# EAGLE design LasaurDriverBoard2 (EAGLE 6.4)
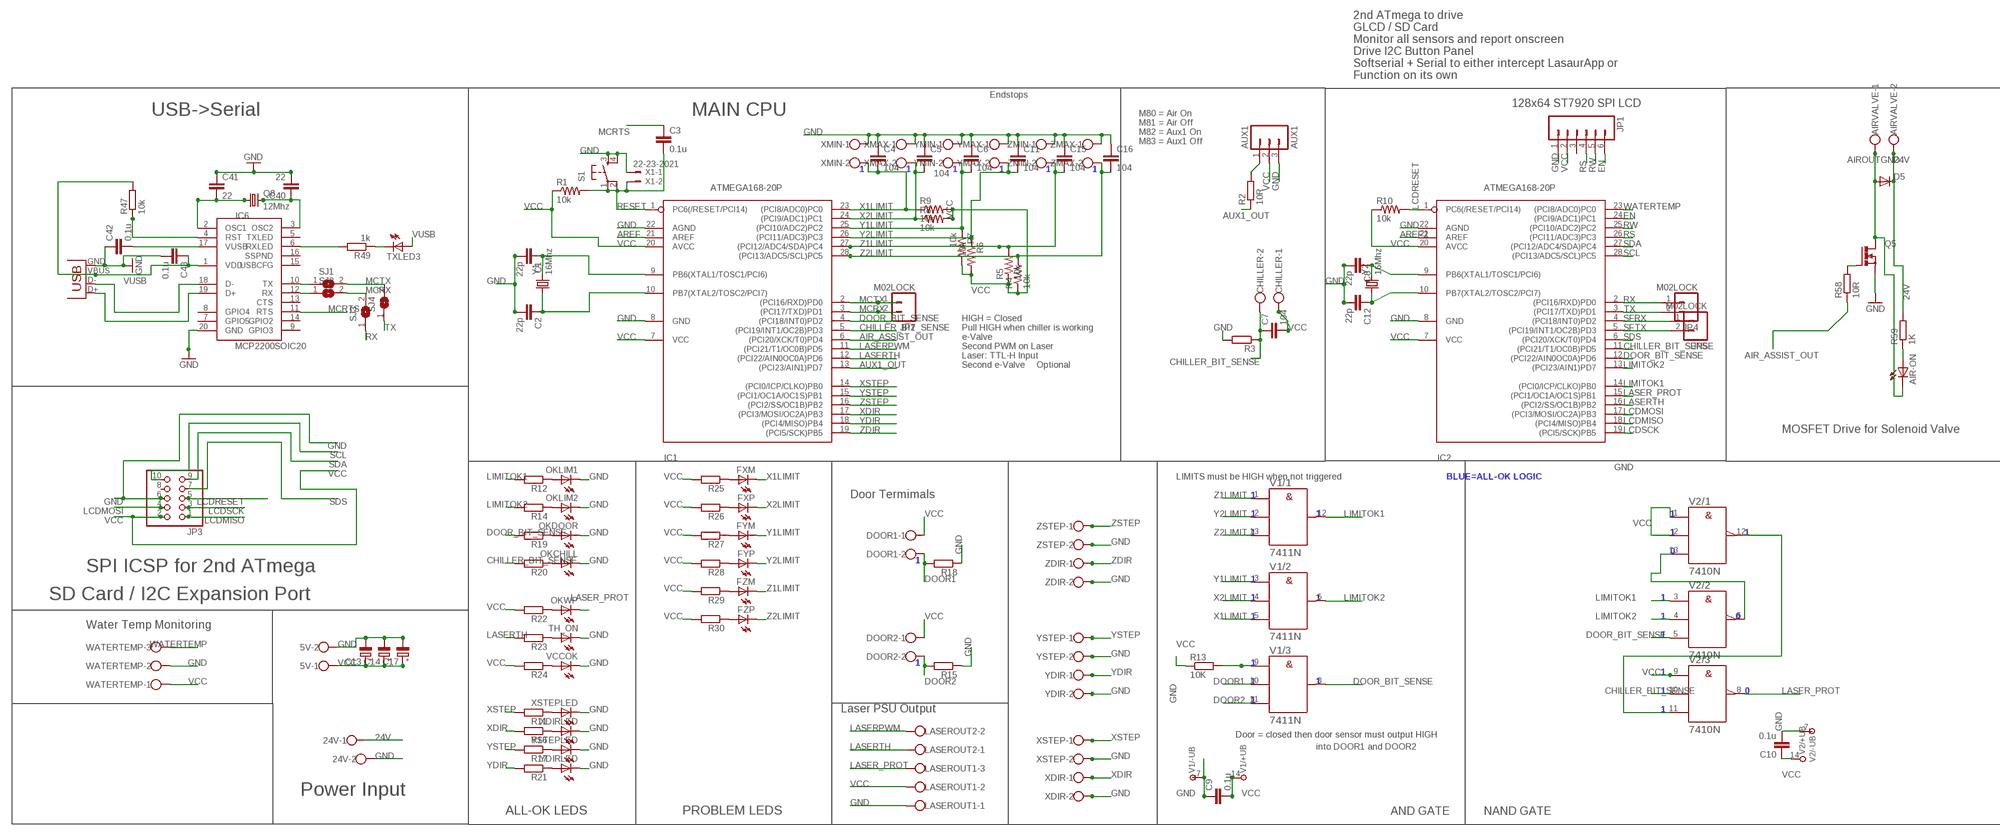
[diagram p0: schematic, sheet 1, part 1 of 2]
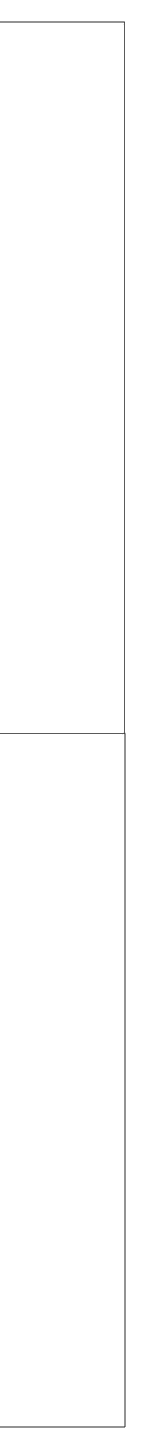
[diagram p1: schematic, sheet 1, part 2 of 2]

## Parts
5V  W237-102  [W237-102]
24V  W237-102  [W237-102]
AIR-ON  LED3MM  [LED3MM]
AIRVALVE  W237-102  [W237-102]
AUX1  AUX1  M03POLAR  [MOLEX-1X3]
C1  22p  CAP1206  [1206]
C2  22p  CAP1206  [1206]
C3  0.1u  CAP1206  [1206]
C4  104  C-EUC1206  [C1206]
C5  C-EUC1206  [C1206]
C6  104  C-EUC1206  [C1206]
C7  104  C-EUC1206  [C1206]
C8  22p  CAP1206  [1206]
C9  0.1u  CAP1206  [1206]
C10  0.1u  CAP1206  [1206]
C11  104  C-EUC1206  [C1206]
C12  22p  CAP1206  [1206]
C13  CPOL-EUB  [PANASONIC_B]
C14  CPOL-EUB  [PANASONIC_B]
C15  104  C-EUC1206  [C1206]
C16  104  C-EUC1206  [C1206]
C17  CPOL-EUB  [PANASONIC_B]
C40  22  CAP1206  [1206]
C41  22  CAP1206  [1206]
C42  0.1u  CAP1206  [1206]
C43  0.1u  CAP1206  [1206]
CHILLER  W237-102  [W237-102]
D5  DIODESMA-ALT  [SMA-DIODE_ALT]
DOOR1  W237-102  [W237-102]
DOOR2  W237-102  [W237-102]
FXM  LED3MM  [LED3MM]
FXP  LED3MM  [LED3MM]
FYM  LED3MM  [LED3MM]
FYP  LED3MM  [LED3MM]
FZM  LED3MM  [LED3MM]
FZP  LED3MM  [LED3MM]
IC1  ATMEGA168-20P  [DIL28-3]
IC2  ATMEGA168-20P  [DIL28-3]
IC6  MCP2200SOIC20  [SOIC20]
JP1  M06LOCK  [1X06_LOCK]
JP2  M02LOCK  [1X02_LOCK]
JP3  PINHD-2X5  [2X05]
JP4  M02LOCK  [1X02_LOCK]
JP5  M02LOCK  [1X02_LOCK]
LASEROUT1  W237-103  [W237-103]
LASEROUT2  W237-102  [W237-102]
OKCHILL  LED3MM  [LED3MM]
OKDOOR  LED3MM  [LED3MM]
OKLIM1  LED3MM  [LED3MM]
OKLIM2  LED3MM  [LED3MM]
OKWP  LED3MM  [LED3MM]
Q5  PMOSFET_NTO220BV  [TO220BV]
Q8  12Mhz  CRYSTALHC49UP  [HC49UP]
R1  10k  R-US_M1206  [M1206]
R2  10R  R-EU_M1206  [M1206]
R3  R-EU_M1206  [M1206]
R4  10k  R-US_M1206  [M1206]
R5  10k  R-US_M1206  [M1206]
R6  10k  R-US_M1206  [M1206]
R7  10k  R-US_M1206  [M1206]
R8  10k  R-US_M1206  [M1206]
R9  10k  R-US_M1206  [M1206]
R10  10k  R-US_M1206  [M1206]
R11  R-EU_M1206  [M1206]
R12  R-EU_M1206  [M1206]
R13  10K  R-EU_M1206  [M1206]
R14  R-EU_M1206  [M1206]
R15  R-EU_M1206  [M1206]
R16  R-EU_M1206  [M1206]
R17  R-EU_M1206  [M1206]
R18  R-EU_M1206  [M1206]
R19  R-EU_M1206  [M1206]
R20  R-EU_M1206  [M1206]
R21  R-EU_M1206  [M1206]
R22  R-EU_M1206  [M1206]
R23  R-EU_M1206  [M1206]
R24  R-EU_M1206  [M1206]
R25  R-EU_M1206  [M1206]
R26  R-EU_M1206  [M1206]
R27  R-EU_M1206  [M1206]
R28  R-EU_M1206  [M1206]
R29  R-EU_M1206  [M1206]
R30  R-EU_M1206  [M1206]
R47  10k  R-EU_M1206  [M1206]
R49  1k  R-EU_M1206  [M1206]
R58  10R  R-EU_M1206  [M1206]
R59  1K  R-EU_M1206  [M1206]
S1  TAC_SWITCHPTH  [TACTILE-PTH]
SJ1  SJ  [SJ]
SJ2  SJ  [SJ]
SJ3  SJ  [SJ]
SJ4  SJ  [SJ]
TH_ON  LED3MM  [LED3MM]
TXLED3  LEDSMT1206  [1206]
V1  7411N  [DIL14]
V2  7410N  [DIL14]
VCCOK  LED3MM  [LED3MM]
WATERTEMP  W237-103  [W237-103]
X1  22-23-2021  [22-23-2021]
X3  USB-SMD-NS  [USB-MINIB-NOSTOP]
XDIR  W237-102  [W237-102]
XDIRLED  LED3MM  [LED3MM]
XMAX  W237-102  [W237-102]
XMIN  W237-102  [W237-102]
XSTEP  W237-102  [W237-102]
XSTEPLED  LED3MM  [LED3MM]
Y1  16Mhz  CRYSTALSMD  [HC49UP]
Y2  16Mhz  CRYSTALSMD  [HC49UP]
YDIR  W237-102  [W237-102]
YDIRLED  LED3MM  [LED3MM]
YMAX  W237-102  [W237-102]
YMIN  104  W237-102  [W237-102]
YSTEP  W237-102  [W237-102]
YSTEPLED  LED3MM  [LED3MM]
ZDIR  W237-102  [W237-102]
ZMAX  W237-102  [W237-102]
ZMIN  W237-102  [W237-102]
ZSTEP  W237-102  [W237-102]

## Nets
24V: 24V.1 AIRVALVE.2 D5.C R59.2
AIR_ASSIST_OUT: IC1.6((PCI20/XCK/T0)PD4) R58.1
AIROUTGND: AIR-ON.K(C) AIRVALVE.1 D5.A Q5.D
AREF: IC1.21(AREF)
AREF2: IC2.21(AREF)
AUX1_OUT: IC1.13((PCI23/AIN1)PD7) R2.1
CHILLER_BIT_SENSE: C7.1 CHILLER.2 IC1.5((PCI19/INT1/OC2B)PD3) IC2.11((PCI21/T1/OC0B)PD5) R3.1 R20.2 V2.10(/3:B)
DOOR1: DOOR1.2 R18.2 V1.10(/3:B)
DOOR2: DOOR2.2 R15.2 V1.11(/3:C)
DOOR_BIT_SENSE: IC1.4((PCI18/INT0)PD2) IC2.12((PCI22/AIN0OC0A)PD6) R19.2 V1.8(/3:Y) V2.5(/2:C)
EN: IC2.24((PCI9/ADC1)PC1) JP1.6
GND: 5V.2 24V.2 AUX1.3 C1.2 C2.2 C4.1 C5.1 C6.1 C8.2 C9.1 C10.2 C11.1 C12.2 C13.- C14.- C15.1 C16.1 C17.- C40.2 C41.1 C42.1 C43.2 IC1.8(GND) IC1.22(AGND) IC2.8(GND) IC2.22(AGND) IC6.20(GND) JP1.1 JP3.6 LASEROUT1.1 OKCHILL.K(C) OKDOOR.K(C) OKLIM1.K(C) OKLIM2.K(C) Q5.S R3.2 R15.1 R18.1 S1.3 S1.4 TH_ON.K(C) V1.7(/-UB:-UB) V2.7(/-UB:-UB) VCCOK.K(C) WATERTEMP.2 X1.1 X3.GND XDIR.2 XDIRLED.K(C) XMAX.1 XMIN.1 XSTEP.2 XSTEPLED.K(C) YDIR.2 YDIRLED.K(C) YMAX.1 YMIN.1 YSTEP.2 YSTEPLED.K(C) ZDIR.2 ZMAX.1 ZMIN.1 ZSTEP.2
LASER_PROT: IC2.15((PCI1/OC1A/OC1S)PB1) LASEROUT1.3 OKWP.K(C) V2.8(/3:Y)
LASERPWM: IC1.11((PCI21/T1/OC0B)PD5) LASEROUT2.2
LASERTH: IC1.12((PCI22/AIN0OC0A)PD6) IC2.16((PCI2/SS/OC1B)PB2) LASEROUT2.1 R23.2
LCDMISO: IC2.18((PCI4/MISO)PB4) JP3.1
LCDMOSI: IC2.17((PCI3/MOSI/OC2A)PB3) JP3.4
LCDRESET: IC2.1(PC6(/RESET/PCI14)) JP3.5 R10.2
LCDSCK: IC2.19((PCI5/SCK)PB5) JP3.3
LIMITOK1: IC2.14((PCI0/ICP/CLKO)PB0) R12.2 V1.12(/1:Y) V2.3(/2:A)
LIMITOK2: IC2.13((PCI23/AIN1)PD7) R14.2 V1.6(/2:Y) V2.4(/2:B)
MCRTS: C3.1 IC6.11(RTS)
MCRX: IC1.3((PCI17/TXD)PD1) JP2.2 SJ2.2 SJ3.2
MCRXPRE: IC6.12(RX) SJ2.1
MCTX: IC1.2((PCI16/RXD)PD0) JP2.1 SJ1.2 SJ4.2
MXTCPRE: IC6.10(TX) SJ1.1
N$1: R11.1 XSTEPLED.A
N$2: R16.1 XDIRLED.A
N$3: AUX1.1 R2.2
N$4: V2.6(/2:Y) V2.13(/1:C)
N$5: OKLIM1.A R12.1
N$6: R17.1 YSTEPLED.A
N$7: R21.1 YDIRLED.A
N$8: R13.2 V1.9(/3:A)
N$10: OKLIM2.A R14.1
N$11: OKDOOR.A R19.1
N$14: OKCHILL.A R20.1
N$15: OKWP.A R22.1
N$17: R23.1 TH_ON.A
N$18: R24.1 VCCOK.A
N$19: FXM.A R25.1
N$20: FXP.A R26.1
N$21: FYM.A R27.1
N$22: FYP.A R28.1
N$23: FZM.A R29.1
N$24: FZP.A R30.1
N$30: Q5.G R58.2
N$31: AIR-ON.A R59.1
N$71: C41.2 IC6.2(OSC1) Q8.1
N$72: C40.1 IC6.3(OSC2) Q8.2
N$74: IC6.18(D-) X3.D-
N$75: IC6.19(D+) X3.D+
N$76: C42.2 IC6.17(VUSB)
N$79: IC6.4(RST) R47.1
N$80: IC6.6(RXLED) R49.2
N$81: R49.1 TXLED3.C
NANDOK: V2.11(/3:C) V2.12(/1:Y)
RESET: C3.2 IC1.1(PC6(/RESET/PCI14)) R1.2 S1.1 S1.2 X1.2
RS: IC2.26((PCI11/ADC3)PC3) JP1.4
RW: IC2.25((PCI10/ADC2)PC2) JP1.5
RX: IC2.2((PCI16/RXD)PD0) JP4.1 SJ3.1
SCL: IC2.28((PCI13/ADC5/SCL)PC5) JP3.10
SDA: IC2.27((PCI12/ADC4/SDA)PC4) JP3.9
SDS: IC2.6((PCI20/XCK/T0)PD4) JP3.7
SFRX: IC2.4((PCI18/INT0)PD2) JP5.1
SFTX: IC2.5((PCI19/INT1/OC2B)PD3) JP5.2
TX: IC2.3((PCI17/TXD)PD1) JP4.2 SJ4.1
VCC: 5V.1 AUX1.2 C7.2 C9.2 C10.1 C13.+ C14.+ C17.+ CHILLER.1 DOOR1.1 DOOR2.1 IC1.7(VCC) IC1.20(AVCC) IC2.7(VCC) IC2.20(AVCC) JP1.2 JP3.2 LASEROUT1.2 R1.1 R4.1 R5.1 R6.2 R7.2 R8.2 R9.2 R10.1 R13.1 R22.2 R24.2 R25.2 R26.2 R27.2 R28.2 R29.2 R30.2 V1.14(/+UB:+UB) V2.1(/1:A) V2.2(/1:B) V2.9(/3:A) V2.14(/+UB:+UB) WATERTEMP.1
VUSB: C43.1 IC6.1(VDD) R47.2 TXLED3.A X3.VBUS
WATERTEMP: IC2.23((PCI8/ADC0)PC0) WATERTEMP.3
X1LIMIT: C4.2 FXM.K(C) IC1.23((PCI8/ADC0)PC0) R9.1 V1.5(/2:C) XMIN.2
X2LIMIT: C5.2 FXP.K(C) IC1.24((PCI9/ADC1)PC1) R8.1 V1.4(/2:B) XMAX.2
XDIR: IC1.17((PCI3/MOSI/OC2A)PB3) R16.2 XDIR.1
XSTEP: IC1.14((PCI0/ICP/CLKO)PB0) R11.2 XSTEP.1
XTAL1: C1.1 IC1.9(PB6(XTAL1/TOSC1/PCI6)) Y1.2
XTAL2: C2.1 IC1.10(PB7(XTAL2/TOSC2/PCI7)) Y1.1
XTAL3: C12.1 IC2.10(PB7(XTAL2/TOSC2/PCI7)) Y2.1
XTAL4: C8.1 IC2.9(PB6(XTAL1/TOSC1/PCI6)) Y2.2
Y1LIMIT: C6.2 FYM.K(C) IC1.25((PCI10/ADC2)PC2) R7.1 V1.3(/2:A) YMIN.2
Y2LIMIT: C11.2 FYP.K(C) IC1.26((PCI11/ADC3)PC3) R6.1 V1.2(/1:B) YMAX.2
YDIR: IC1.18((PCI4/MISO)PB4) R21.2 YDIR.1
YSTEP: IC1.15((PCI1/OC1A/OC1S)PB1) R17.2 YSTEP.1
Z1LIMIT: C15.2 FZM.K(C) IC1.27((PCI12/ADC4/SDA)PC4) R5.2 V1.1(/1:A) ZMIN.2
Z2LIMIT: C16.2 FZP.K(C) IC1.28((PCI13/ADC5/SCL)PC5) R4.2 V1.13(/1:C) ZMAX.2
ZDIR: IC1.19((PCI5/SCK)PB5) ZDIR.1
ZSTEP: IC1.16((PCI2/SS/OC1B)PB2) ZSTEP.1
Unconnected: IC6.5(TXLED) IC6.7(GPIO5) IC6.8(GPIO4) IC6.9(GPIO3) IC6.13(CTS) IC6.14(GPIO2) IC6.15(USBCFG) IC6.16(SSPND) JP1.3 JP3.8

## Notes on the sheet
- 2nd ATmega to drive
  GLCD / SD Card
  Monitor all sensors and report onscreen
  Drive I2C Button Panel
  Softserial + Serial to either intercept LasaurApp or 
  Function on its own
- Endstops
- 128x64 ST7920 SPI LCD
- USB->Serial | MAIN CPU | M80 = Air On
- M81 = Air Off
- M82 = Aux1 On
- M83 = Aux1 Off
- 1 | 1 | 1 | 1 | 1 | 1
- HIGH = Closed
- Pull HIGH when chiller is working
- e-Valve
- Second PWM on Laser
- Laser: TTL-H Input
- Second e-Valve | Optional
- MOSFET Drive for Solenoid Valve
- LIMITS must be HIGH when not triggered | BLUE=ALL-OK LOGIC
- Door Termimals | 1
- 1 | 1 | 1
- 1 | 1 | 1
- 0
- 1
- SPI ICSP for 2nd ATmega
- 1
- SD Card / I2C Expansion Port | 1 | 1 | 1
- 1 | 1 | 0
- Water Temp Monitoring
- 1
- 1 | 1
- 1
- 1 | 1
- 1 | 0
- 1
- Laser PSU Output | 1
- Door = closed then door sensor must output HIGH
- into DOOR1 and DOOR2
- Power Input
- ALL-OK LEDS | PROBLEM LEDS | AND GATE | NAND GATE

## Library data of the parts
5V 24V AIRVALVE CHILLER DOOR1 DOOR2 LASEROUT2 XDIR XMAX XMIN XSTEP YDIR YMAX YMIN YSTEP ZDIR ZMAX ZMIN ZSTEP = con-wago-500:W237-102: WAGO SCREW CLAMP; MPN: 237-102; OC_FARNELL: unknown; OC_NEWARK: 70K9898
AIR-ON = adafruit:LED: LED
AUX1 = SparkFun-Connectors:M03: Header 3 Standard 3-pin 0.1" header. Use with straight break away headers (SKU : PRT-00116), right angle break away headers (PRT-00553), swiss pins (PRT-00743), machine pins (PRT-00117), and female headers (PRT-00115). Molex polarized connector foot print use with SKU : PRT-08232 with associated crimp pins and housings.
C1-C3 C8-C10 C12 C40-C43 = SparkFun-Passives:CAP: Capacitor Standard 0603 ceramic capacitor, and 0.1" leaded capacitor.
C4-C7 C11 C15 C16 = rcl:C-EU: CAPACITOR, European symbol
C13 C14 C17 = rcl:CPOL-EU: POLARIZED CAPACITOR, European symbol
D5 = SparkFun-DiscreteSemi:DIODE: Diode These are standard reverse protection diodes and small signal diodes. SMA package can handle up to about 1A. SOD-323 can handle about 200mA. What the SOD-323 package when ordering, there are some mfgs out there that are 5-pin packages.
FXM FXP FYM FYP FZM FZP OKCHILL OKDOOR OKLIM1 OKLIM2 OKWP TH_ON TXLED3 VCCOK XDIRLED XSTEPLED YDIRLED YSTEPLED = led:LED: LED
IC1 IC2 = adafruit:ATMEGA168*P: MICROCONTROLLER 16 kBytes FLASH 1 kBytes SRAM 512 Bytes EEPROM USART 8-channel 10 bit ADC
IC6 = microchip-update-2:MCP2200: USB 2.0 to UART Protocol Converter with GPIO
JP1 = SparkFun-Connectors:M06: Header 6 Standard 6-pin 0.1" header. Use with straight break away headers (SKU : PRT-00116), right angle break away headers (PRT-00553), swiss pins (PRT-00743), machine pins (PRT-00117), and female headers (PRT-00115). Molex polarized connector foot print use with SKU : PRT-08094 with associated crimp pins and housings. NOTES ON THE VARIANTS LOCK and LOCK_LONGPADS... This footprint was designed to help hold the alignment of a through-hole component (i.e. 6-pin header) while soldering it into place. You may notice that each hole has been shifted either up or down by 0.005 of an inch from it's more standard position (which is a perfectly straight line). This slight alteration caused the pins (the squares in the middle) to touch the edges of the holes. Because they are alternating, it causes a "brace" to hold the component in place. 0.005 has proven to be the perfect amount of "off-center" position when using our standard breakaway headers. Although looks a little odd when you look at the bare footprint, once you have a header in there, the alteration is very hard to notice. Also,if you push a header all the way into place, it is covered up entirely on the bottom side. This idea of altering the position of holes to aid alignment will be further integrated into the Sparkfun Library for other footprints. It can help hold any component with 3 or more connection pins.
JP2 JP4 JP5 = SparkFun-Connectors:M02: Standard 2-pin 0.1" header. Use with - straight break away headers ( PRT-00116) - right angle break away headers (PRT-00553) - swiss pins (PRT-00743) - machine pins (PRT-00117) - female headers (PRT-00115) Molex polarized connector foot print use with: PRT-08233 with associated crimp pins and housings. 2.54_SCREWTERM for use with PRT-10571. 3.5mm Screw Terminal footprints for PRT-08084 5mm Screw Terminal footprints for use with PRT-08433
JP3 = pinhead:PINHD-2X5: PIN HEADER
LASEROUT1 WATERTEMP = con-wago-500:W237-103: WAGO SCREW CLAMP; MPN: 237-103; OC_FARNELL: unknown; OC_NEWARK: 18M7116
Q5 = transistor-power:PMOSFET_N: Power MOSFET N-Channel
Q8 = adafruit:CRYSTAL: CRYSTAL; OC_FARNELL: unknown; OC_NEWARK: unknown
R1 R10 = resistor:R-US_: RESISTOR, American symbol
R2 R3 R11-R30 R47 R49 R58 R59 = resistor:R-EU_: RESISTOR, European symbol
R4-R9 = adafruit:R-US_: RESISTOR, American symbol
S1 = SparkFun-Electromechanical:TAC_SWITCH: Momentary Switch Button commonly used for reset or general input. Spark Fun Electronics SKU : COM-00097
SJ1-SJ4 = jumper:SJ: SMD solder JUMPER
V1 = 74ttl-din:74*11: Triple 3-input AND gate
V2 = 74ttl-din:74*10: Triple 3-input NAND gate
X1 = con-molex:22-23-2021: .100" (2.54mm) Center Header - 2 Pin; MF: MOLEX; MPN: 22-23-2021; OC_FARNELL: 1462926; OC_NEWARK: 25C3832
X3 = SparkFun-Connectors:USB: USB Connectors USB-B-PTH is fully proven SKU : PRT-00139 USB-miniB is fully proven SKU : PRT-00587 USB-A-PCB is untested. USB-A-H is throughly reviewed, but untested. Spark Fun Electronics SKU : PRT-00437 USB-B-SMT is throughly reviewed, but untested. Needs silkscreen touching up. USB-A-S has not been used/tested USB-MB-H has not been used/tested
Y1 Y2 = SparkFun-FreqCtrl:CRYSTAL: Various standard crystals. Proven footprints. Spark Fun Electronics SKU : COM-00534

## Net classes
4 aref: width 0.406 mm, drill 0.61 mm, clearance 0.254 mm

## Board
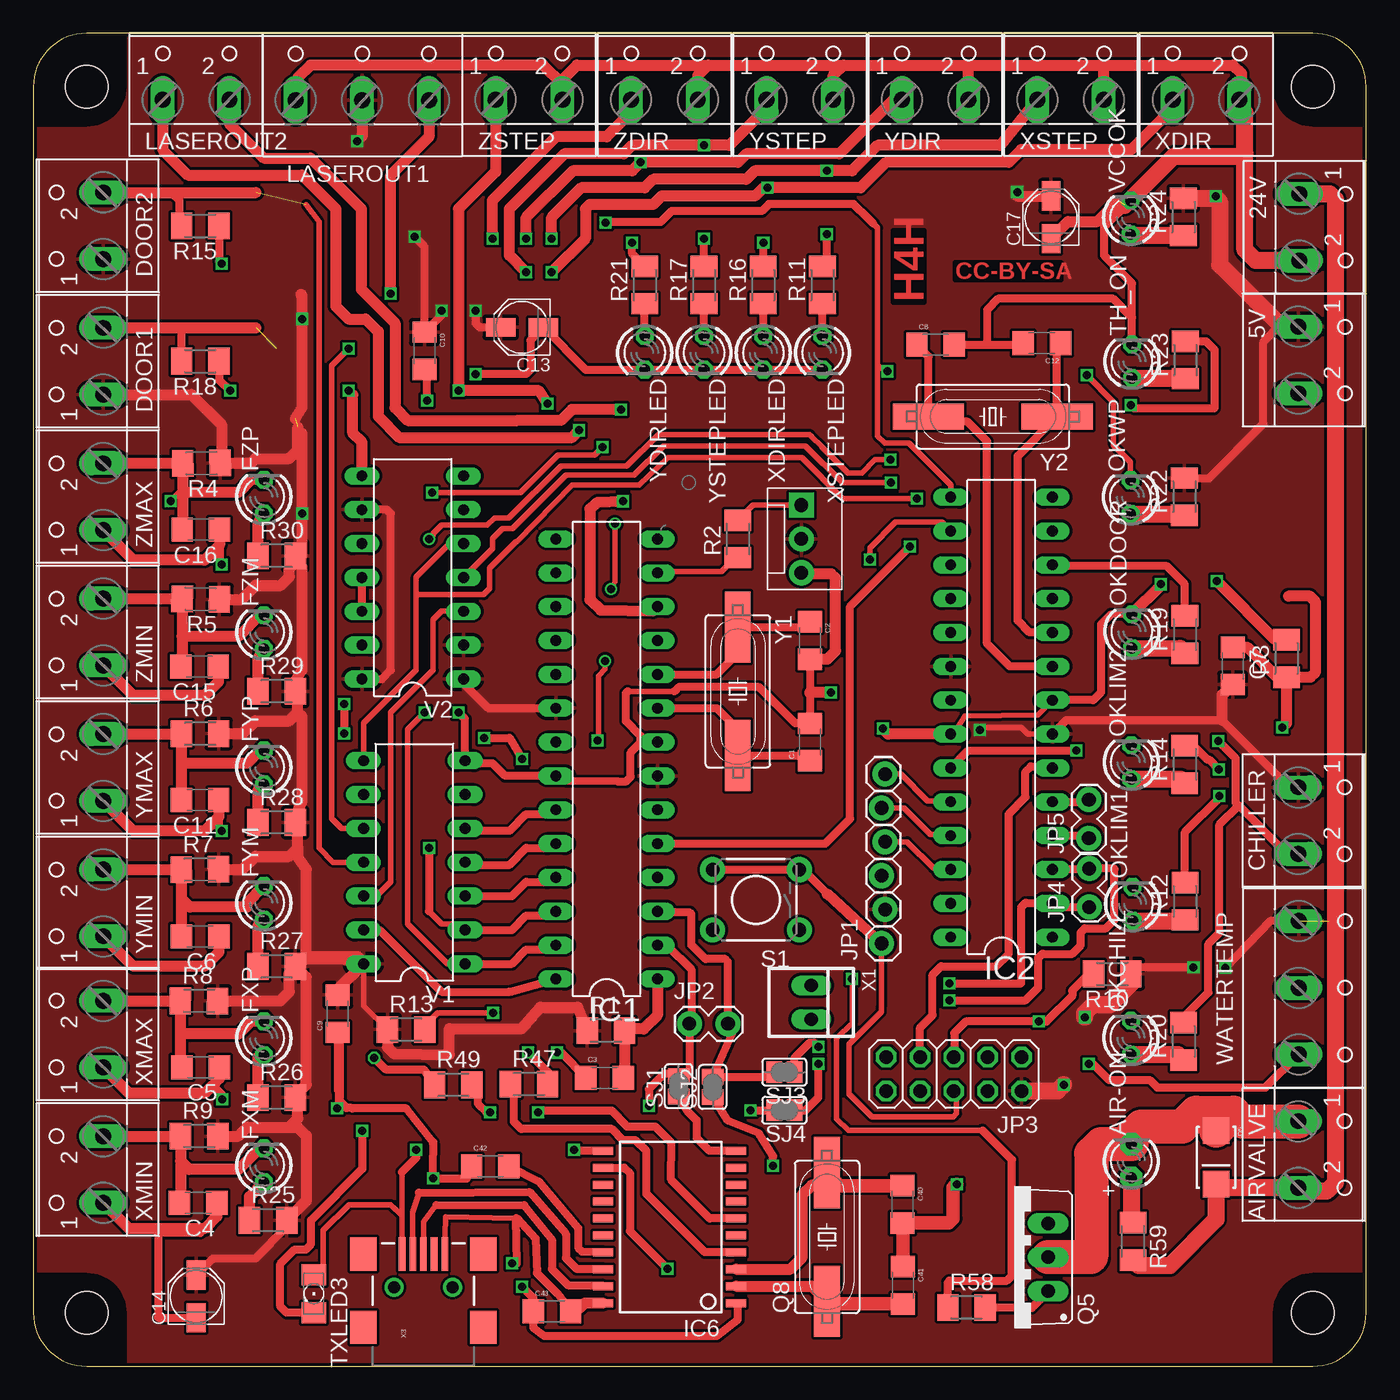
[diagram p2: board, top side]
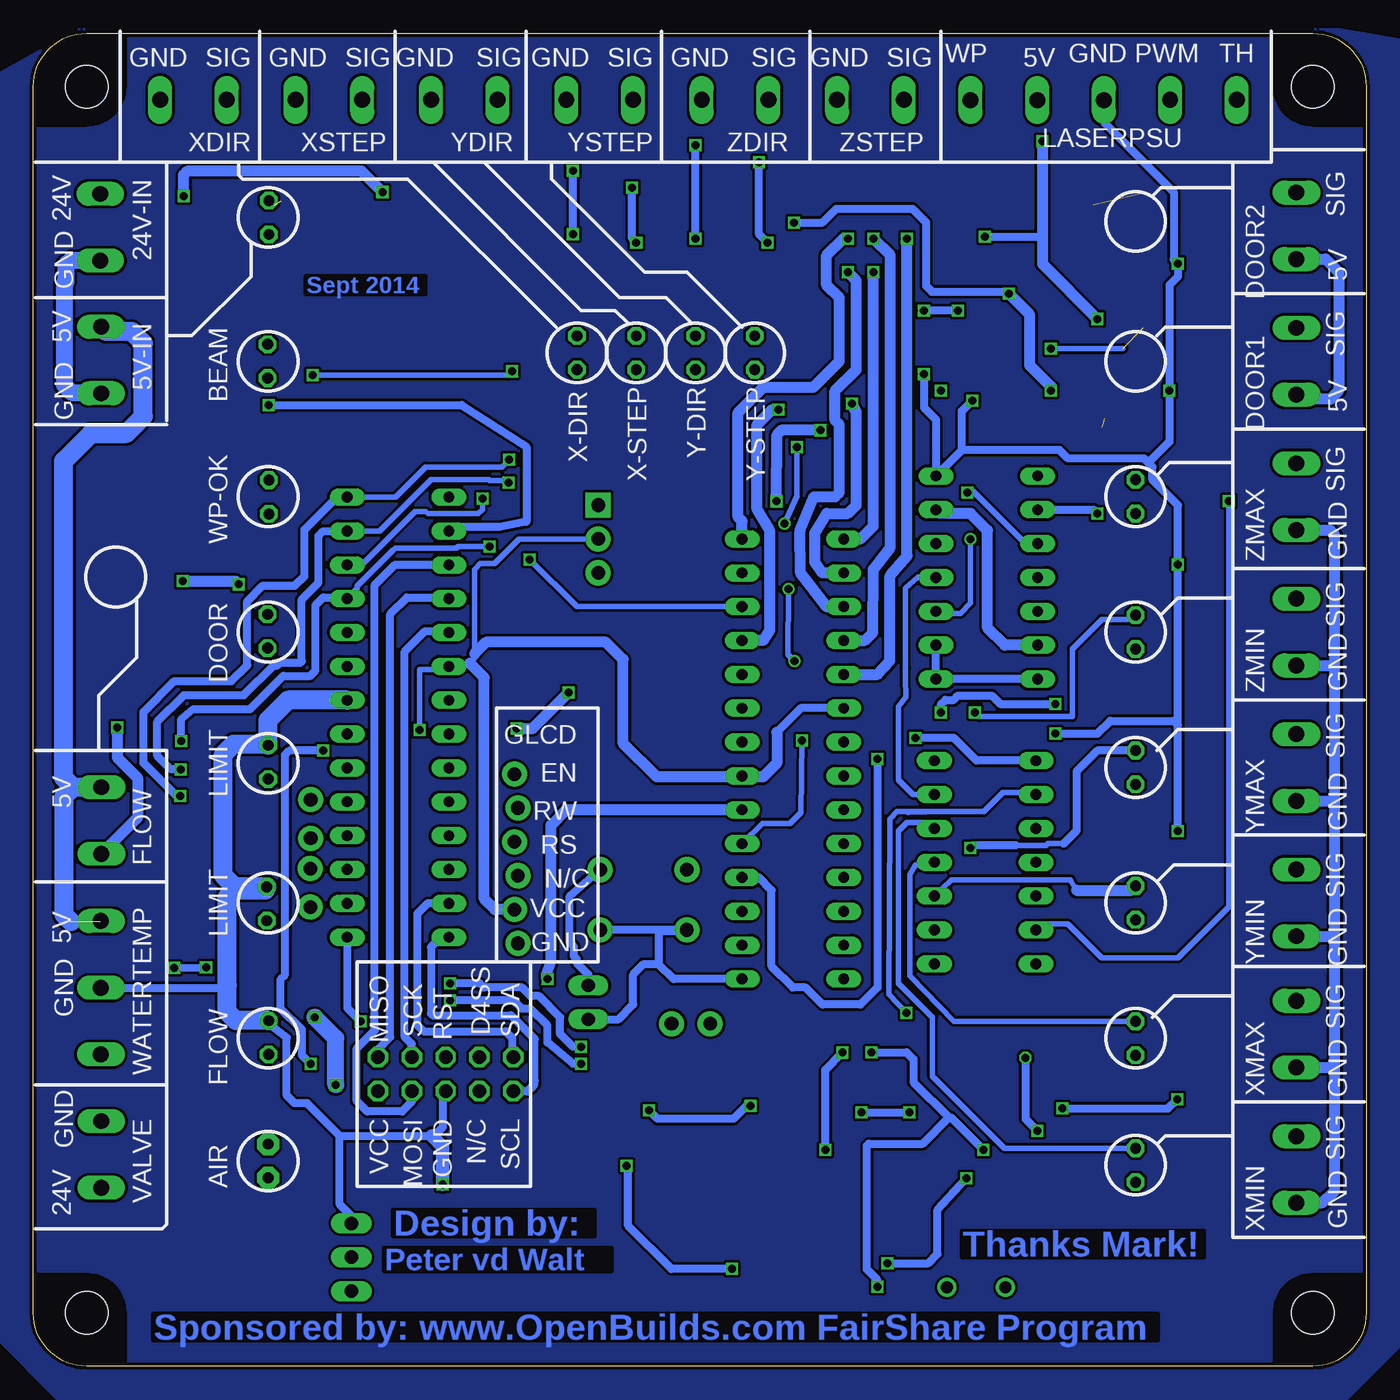
[diagram p3: board, bottom side, seen from below]

Size 100 x 100 mm. Coordinates in mm from the lower left corner, seen from the top.
Copper layers (1*16): Top 0.035mm / dielectric 1.5mm / Bottom 0.035mm
Design rules "dirt_cheap_dirty_boards.v1 *": minimum track width 5mil, minimum drill 12mil, track to track 8mil, track to pad 8mil, pad to pad 8mil, via to via 5mil, smd to smd 0mil, copper to edge 10mil, drill to drill 10mil, minimum pad ring 10mil, minimum via ring 6mil, stop-mask expansion 2mil, vias tented up to drill 25mil, thermal gap 10mil

### Footprints (pad centres in the part's own frame; a part is rotated, then mirrored left to right if it is on the bottom)
W237-102 = drill 1.194 long: 1 -2.5,-1.27; 2 2.5,-1.27
LED3MM = drill 0.813 pad 1.676 octagon: A -1.27,0; K 1.27,0
MOLEX-1X3 = drill 1.016 pad 1.88 square: 1 0,0 | drill 1.016 pad 1.88: 2 2.54,0; 3 5.08,0
1206 = smd 1.6 x 1.8: 1 -1.4,0; 2 1.4,0
C1206 = smd 1.6 x 1.8: 1 -1.4,0; 2 1.4,0
PANASONIC_B = smd 2.2 x 1.4: + 1.6,0; - -1.6,0
SMA-DIODE_ALT = smd 2 x 2: A -2,0; C 2,0
LED3MM' = drill 0.813 octagon: A -1.27,0; K 1.27,0
DIL28-3 = drill 0.813 long: 1 -16.51,-3.81; 2 -13.97,-3.81; 3 -11.43,-3.81; 4 -8.89,-3.81; 5 -6.35,-3.81; 6 -3.81,-3.81; 7 -1.27,-3.81; 8 1.27,-3.81; 9 3.81,-3.81; 10 6.35,-3.81; 11 8.89,-3.81; 12 11.43,-3.81; 13 13.97,-3.81; 14 16.51,-3.81; 15 16.51,3.81; 16 13.97,3.81; 17 11.43,3.81; 18 8.89,3.81; 19 6.35,3.81; 20 3.81,3.81; 21 1.27,3.81; 22 -1.27,3.81; 23 -3.81,3.81; 24 -6.35,3.81; 25 -8.89,3.81; 26 -11.43,3.81; 27 -13.97,3.81; 28 -16.51,3.81
SOIC20 = smd 0.6 x 1.5: 1 -5.715,-5; 2 -4.445,-5; 3 -3.175,-5; 4 -1.905,-5; 5 -0.635,-5; 6 0.635,-5; 7 1.905,-5; 8 3.175,-5; 9 4.445,-5; 10 5.715,-5; 11 5.715,5; 12 4.445,5; 13 3.175,5; 14 1.905,5; 15 0.635,5; 16 -0.635,5; 17 -1.905,5; 18 -3.175,5; 19 -4.445,5; 20 -5.715,5
1X06_LOCK = drill 1.016 pad 1.88: 1 0,0; 2 2.54,-0.254; 3 5.08,0; 4 7.62,-0.254; 5 10.16,0; 6 12.7,-0.254
1X02_LOCK = drill 1.016 pad 1.88: 1 -0.178,0; 2 2.718,0
2X05 = drill 1.016 octagon: 1 -5.08,-1.27; 2 -5.08,1.27; 3 -2.54,-1.27; 4 -2.54,1.27; 5 0,-1.27; 6 0,1.27; 7 2.54,-1.27; 8 2.54,1.27; 9 5.08,-1.27; 10 5.08,1.27
W237-103 = drill 1.194 long: 1 -5,-1.29; 2 0,-1.29; 3 5,-1.29
TO220BV = drill 1.016 long: D 0,-2.54; G -2.54,-2.54; S 2.54,-2.54
HC49UP = smd 5.334 x 1.93: 1 -4.826,0; 2 4.826,0
M1206 = smd 1.6 x 2: 1 -1.4,0; 2 1.4,0
TACTILE-PTH = drill 1.016 pad 1.88: 1 -3.251,2.261; 2 3.251,2.261; 3 -3.251,-2.261; 4 3.251,-2.261
SJ = smd 1.168 x 1.6: 1 -0.762,0; 2 0.762,0
1206' = smd 1.6 x 1.803: A -1.422,0; C 1.422,0
DP100100_V1 = hole 3.2: -46,-46; 46,-46; 46,46; -46,46
DIL14 = drill 0.813 long: 1 -7.62,-3.81; 2 -5.08,-3.81; 3 -2.54,-3.81; 4 0,-3.81; 5 2.54,-3.81; 6 5.08,-3.81; 7 7.62,-3.81; 8 7.62,3.81; 9 5.08,3.81; 10 2.54,3.81; 11 0,3.81; 12 -2.54,3.81; 13 -5.08,3.81; 14 -7.62,3.81
22-23-2021 = drill 1 long: 1 -1.27,0; 2 1.27,0
USB-MINIB-NOSTOP = smd 2.5 x 0.5: D+ 2.5,0; D- 2.5,0.8; GND 2.5,-1.6; ID 2.5,-0.8; VBUS 2.5,1.6 | smd 2.5 x 2: G1 -3,-4.5; G2 -3,4.5; G3 2.5,4.5; G4 2.5,-4.5 | drill 0.9 pad 0.8: H1 0,2.2 | drill 0.9 pad 0.787: H2 0,-2.2

### Placement (x,y rotation side)
5V  96.19,75.49 270 top
24V  96.25,85.45 270 top
AIR-ON  82.38,15.39 90 top
AIRVALVE  96.18,15.89 270 top
AUX1  57.62,64.61 270 top
C1  58.26,46.83 90 top
C2  58.26,54.45 270 top
C3  42.86,21.65 0 top
C4  12.37,12.25 180 top
C5  12.56,22.43 180 top
C6  12.51,32.24 180 top
C7  89.98,52.54 270 top
C8  67.69,76.63 0 top
C9  22.85,26.44 90 top
C10  29.35,76.19 270 top
C11  12.51,42.47 180 top
C12  75.67,76.76 180 top
C13  36.66,77.94 180 top
C14  12.22,5.23 90 top
C15  12.47,52.5 180 top
C16  12.57,62.76 180 top
C17  76.35,86.2 90 top
C40  65.22,12.14 270 top
C41  65.24,6.07 270 top
C42  34.28,15 0 top
C43  38.91,4.11 0 top
CHILLER  96.17,40.94 270 top
D5  88.73,15.67 270 top
DOOR1  3.96,75.4 90 top
DOOR2  3.96,85.56 90 top
FXM  [LED3MM']  17.3,15.08 90 top
FXP  [LED3MM']  17.3,24.6 90 top
FYM  [LED3MM']  17.3,34.76 90 top
FYP  [LED3MM']  17.3,44.92 90 top
FZM  [LED3MM']  17.3,55.08 90 top
FZP  [LED3MM']  17.3,65.24 90 top
IC1  43.02,45.55 90 top
IC2  72.64,48.69 90 top
IC6  47.73,10.45 90 top
JP1  63.65,31.72 90 top
JP2  49.4,25.68 0 top
JP3  69.07,21.91 180 top
JP4  79.22,34.62 90 top
JP5  79.19,39.79 90 top
LASEROUT1  24.68,96.28 0 top
LASEROUT2  12.21,96.28 0 top
OKCHILL  [LED3MM']  82.35,24.66 90 top
OKDOOR  [LED3MM']  82.43,55.14 90 top
OKLIM1  [LED3MM']  82.48,34.69 90 top
OKLIM2  [LED3MM']  82.38,45.32 90 top
OKWP  [LED3MM']  82.32,65.21 90 top
Q5  73.59,8.17 90 top
Q8  59.55,9.7 90 top
R1  42.95,25.17 0 top
R2  52.86,62.07 90 top
R3  94.01,53.1 90 top
R4  12.61,67.75 180.7 top
R5  12.56,57.55 179.2 top
R6  12.5,47.45 0.1 top
R7  12.5,37.26 0.4 top
R8  12.43,27.4 359.7 top
R9  12.44,17.26 0 top
R10  80.94,29.44 180 top
R11  59.21,81.11 90 top
R12  86.4,34.89 90 top
R13  27.97,25.25 0 top
R14  86.38,45.14 90 top
R15  12.54,85.56 180 top
R16  54.76,81.11 90 top
R17  50.32,81.11 90 top
R18  12.54,75.4 180 top
R19  86.39,54.89 90 top
R20  86.3,24.36 90 top
R21  45.87,81.11 90 top
R22  86.35,65.23 90 top
R23  86.44,75.49 90 top
R24  86.29,86.22 90 top
R25  17.61,10.95 0 top
R26  18.25,20.16 0 top
R27  18.25,30 0 top
R28  18.25,40.79 0 top
R29  18.25,50.63 0 top
R30  18.25,60.8 0 top
R47  37.18,21.16 0 top
R49  31.51,21.11 0 top
R58  70.02,4.4 0 top
R59  82.51,9.36 270 top
S1  54.21,34.99 180 top
SJ1  48.42,21 90 top
SJ2  50.98,20.95 90 top
SJ3  56.35,22.06 180 top
SJ4  56.35,19.2 180 top
TH_ON  [LED3MM']  82.42,75.4 90 top
TXLED3  [1206']  21.05,5.43 270 top
U$2  [DP100100_V1]  50,50 180 top
U$6  [LOGO]  49.68,58.89 90 top
V1  28.58,37.81 90 top
V2  28.46,59.17 90 top
VCCOK  [LED3MM']  82.33,86.19 90 top
WATERTEMP  96.22,28.4 270 top
X1  58.36,27.29 270 top
X3  29.27,5.91 90 top
XDIR  87.99,96.28 0 top
XDIRLED  [LED3MM']  54.76,76.03 270 top
XMAX  3.96,24.92 90 top
XMIN  3.96,14.76 90 top
XSTEP  77.83,96.28 0 top
XSTEPLED  [LED3MM']  59.21,76.03 270 top
Y1  52.86,50.63 270 top
Y2  71.98,71.24 180 top
YDIR  67.67,96.28 0 top
YDIRLED  [LED3MM']  45.87,76.03 270 top
YMAX  3.96,44.92 90 top
YMIN  3.96,34.76 90 top
YSTEP  57.51,96.28 0 top
YSTEPLED  [LED3MM']  50.32,76.03 270 top
ZDIR  47.35,96.28 0 top
ZMAX  3.96,65.24 90 top
ZMIN  3.96,55.08 90 top
ZSTEP  37.19,96.28 0 top

### Tracks (layer width: path | path; a pad name or v marks a point on that pad's centre or on a via)
24V
  Top 1.27: 24V.1 97.27,87.95 97.68,87.54 97.68,13.76 97.04,13.12 95.18,13.12 AIRVALVE.2 89.02,13.39 D5.C 88.73,11.01 85.27,7.55 82.92,7.55 R59.2
AIR_ASSIST_OUT  (via drill 0.6)
  Top 0.406: v61.43,29.04 61.44,29.03 61.44,25.77 60.27,24.59 60.27,24.45 60.25,24.43 60.25,18.57 61.14,17.68 71.22,17.68
  Top 0.61: R58.1 68.62,6.31 68.72,6.42 73.04,6.42 73.42,6.8 73.42,15.48 71.22,17.68
  Bottom 0.61: v61.43,29.04 61.43,29.36 61.48,29.1
  Bottom 0.813: 61.48,29.1 61.49,29.4 61.16,30.37 61.16,40.58 59.98,41.76 46.84,41.76 IC1.6
AIROUTGND
  Top 2.184: 90.72,18.36 90.06,19.02 90.06,19 | 94.88,18.36 AIRVALVE.1
  Top 2.54: 90.06,19.02 87.23,19.02 86.2,17.98 83.12,17.98 82.38,17.25 AIR-ON.K 80.1,16.66 79.37,15.94 79.37,8.21 79.34,8.18 77.24,8.18 Q5.D | 90.72,18.36 94.88,18.36 | 90.06,19 D5.A
AUX1_OUT
  Top 0.406: R2.1 52.68,60.66 51.63,59.62 46.92,59.62 IC1.13
CHILLER_BIT_SENSE  (via drill 0.6)
  Top 0.406: v42.33,46.93 42.39,47.07 42.39,51.79 42.9,52.3 v42.9,52.92 | v29.92,65.54 36.55,65.54 39.37,68.36 42.1,68.36 v42.71,68.97 | v43.63,63.22 43.65,58.89 v43.34,58.3
  Top 0.61: CHILLER.2 94.05,38.44 90.43,42.06 | 90.43,42.06 90.21,42.27 90.21,45.6 v88.92,46.89 | 90.43,42.06 89,40.63 89,32.51 88.17,31.68 88.17,28.04 86.3,26.17 R20.2 | IC1.5 59.43,39.2 61.28,41.06 61.28,56.99 v65.78,61.49
  Top 0.813: R3.1 94.01,48.23 v93.7,47.92 | R3.1 95.82,51.7 96.21,52.09 96.21,57.33 95.78,57.77 94.17,57.77 | C7.1 91.07,53.94 93.37,51.64 93.96,51.64 R3.1
  Bottom 0.406: V2.10 25.57,61.71 29.52,65.66 29.79,65.66 v29.92,65.54 | v42.33,46.93 42.41,41.55 43.25,40.72 45.29,40.73 IC1.5 | v65.78,61.49 68.12,61.49 68.23,61.39 72.83,61.39 73,61.22 73.01,61.22 75.7,58.53 75.7,58.34 IC2.11 | v42.71,68.97 42.71,65.28 v43.63,63.22 | v43.34,58.3 43.39,53.41 v42.9,52.92
  Bottom 0.61: v88.92,46.89 88.91,48.54 87.99,49.29 83.75,49.29 81.25,51.79 79.23,51.79 78.82,52.2 78.82,57.1 78.24,57.68 76.54,57.68 IC2.11
  Bottom 0.813: v93.7,47.92 93.7,45.66 92.18,44.14 92.18,41.15 CHILLER.2
DOOR1  (via drill 0.6)  (1 unrouted)
  Top 0.406: V1.10 23.14,40.35 22.38,41.11 22.38,75.08 v23.65,76.35
  Top 0.61: R18.2 11.13,77.71 10.95,77.9
  Top 0.813: DOOR1.2 10.95,77.9 16.7,77.9
  Bottom 0.406: v23.65,76.35 18.25,76.35
DOOR2  (1 unrouted)
  Top 0.406: V1.11 22.5,37.81 21.42,38.89 21.42,85.88 20.47,87.15
  Top 0.61: DOOR2.2 10.35,88.06 10.95,87.46 10.95,85.75 R15.2
  Top 0.813: DOOR2.2 16.7,88.06
DOOR_BIT_SENSE  (via drill 0.6)
  Top 0.406: V1.8 24.77,48.27 28.73,52.22 28.73,57.88 | 28.73,57.88 28.73,59.21 31.27,61.75 32.24,61.75 V2.5 | v66.31,65.11 60.72,65.11 57.67,68.17 47.6,68.17 45.46,66.12 40.43,66.12 36.28,61.87 36.22,61.87 34.24,59.9 34.24,58.33 33.79,57.88 29.36,57.88 28.73,57.88
  Top 0.61: v33.81,47.14 35.71,47.14 v36.66,45.55 | R19.2 86.39,58.68 85.05,60.02 76.55,60.02 IC2.12
  Bottom 0.406: IC2.12 75.35,60.12 71.37,64.11 70.55,64.11 70.4,63.95 66.62,63.95 66.62,63.96 66.3,64.28 66.3,65.1 v66.31,65.11 66.34,65.08
  Bottom 0.61: V1.8 29.24,45.43 30.95,47.14 v33.81,47.14 | v36.66,45.55 36.66,28.41 37.93,27.14 40.79,27.14 42.06,28.41 43.01,28.41 44.6,30 44.6,35.71 45.55,36.66 IC1.4
EN
  Top 0.406: JP1.6 65.08,44.42 67.09,42.42 68.75,42.42 IC2.24
GND  (via drill 0.6)  (1 unrouted)
  Top 0.406: 48.09,50.63 44.6,50.63 | JP1.1 63.62,26.94 63.62,26.58 61.18,24.13 61.18,20.42 61.25,20.35 61.27,20.35 62.9,18.71 69.01,18.71 69.27,18.96 69.27,20.44 JP3.6 | IC2.22 69.02,47.42 69.91,48.76 75.35,48.87 IC2.8 | X3.GND 30.94,11.22 36.19,11.08
  Top 0.61: C16.1 13.97,60.32 v14.12,60.16 | 13.17,10.31 12.85,10.31 12.53,9.99 9.36,9.99 9.36,3.64 9.37,3.63 C14.- | 7.18,10.31 7.18,10.23 | R18.1 13.93,74 v14.76,73.18 | R15.1 13.93,82.89 v14.12,82.7 | C11.1 13.91,40.37 v14.12,40.16 | v31.9,49.05 32.39,48.56 V1.7 32.58,45.24 34.44,45.24 35.39,44.28 IC1.22 39.99,43.92 43.81,43.87 44.47,43.87 44.82,44.22 44.82,46.04 45.56,46.78 | v23.33,49.68 v23.33,47.46 | IC1.8 45.56,46.78 | C2.2 58.25,50.53 C1.2 57.17,48.22 54.44,50.95 48.41,50.95 48.09,50.63 | 45.56,46.78 45.56,47.29 44.46,48.4 44.46,50.49 44.6,50.63 | C8.2 71.39,76.63 | 71.39,76.63 73.82,76.63 C12.2 | VCCOK.K 80.35,85.48 80.35,83.32 82.42,81.25 TH_ON.K 82.42,78.68 81.03,80.08 72.39,80.08 71.55,79.24 71.55,76.78 71.39,76.63 | OKDOOR.K 80.84,56.39 80.1,55.66 80.1,50.55 79.52,49.96 IC2.8 | v29.55,72.45 29.55,74.59 C10.2 | 40.55,3.92 39.54,5.18 39.29,5.47 37.78,6.99 37.69,9.57 36.25,11.12 36.19,11.08 36.27,7.71 v35.91,7.73 | C42.1 32.51,14.08 v30,14.08 29.98,15.15 30.03,16.54 30,16.8 27.98,19.33 23.94,19.33 23.89,19.38 23.5,19.38 23.01,19.88 23.01,24.88 C9.1 22.85,20.71 22.89,20.67 22.89,19.44 v22.79,19.33 | v14.18,20.03 14.18,20.34 13.45,21.07 | S1.4 S1.3 57.74,37.25 59.57,35.42 | v33.17,74.45 36.98,74.45 37.3,74.76 37.3,76.97 C13.- 41.44,74.76 YDIRLED.K YSTEPLED.K XDIRLED.K XSTEPLED.K
  Top 0.813: C4.1 13.77,11.23 12.85,10.31 7.18,10.31 XMIN.1 | C5.1 13.96,21.58 13.45,21.07 12.85,20.47 7.18,20.47 XMAX.1 | C6.1 13.91,31.06 12.85,30 7.49,30 YMIN.1 | C11.1 13.91,41.21 12.85,40.16 7.49,40.16 YMAX.1 | C15.1 13.87,51.34 12.85,50.32 7.49,50.32 ZMIN.1 | C16.1 13.97,61.59 12.85,60.48 7.49,60.48 ZMAX.1 | 19.68,93.66 LASEROUT1.1 19.84,95.15 19.84,96.67 20.79,97.62 38.25,97.62 39.69,96.19 ZSTEP.2 39.69,96.52 40.79,97.62 50.63,97.62 | 50.63,97.62 60.79,97.62 | 60.79,97.62 70.32,97.62 | 70.32,97.62 80.48,97.62 | 80.48,97.62 90,97.62 90.64,96.99 90.64,95.15 XDIR.2 | XSTEP.2 80.33,97.48 80.48,97.62 | YDIR.2 70.17,97.48 70.32,97.62 | YSTEP.2 60.01,96.84 60.79,97.62 | ZDIR.2 49.85,96.84 50.63,97.62 | C2.2 59.57,53.04 60.19,53.66 60.19,59.12 59.86,59.45 57.7,59.45 AUX1.3 | IC2.22 64.13,47.42 v63.73,47.83 | v59.85,50.53 58.25,50.53 | R3.2 93.19,54.5 v88.8,58.89 | v84.58,58.66 84.58,58.57 OKDOOR.K | JP1.1 63.59,31.72 59.57,35.42 | 57.86,37.33 S1.3 | IC6.20 41.36,4.73 40.55,3.92 C43.2 | C17.- 77.63,85.88 79.84,85.88 81.42,87.46 VCCOK.K
  Top 1.016: C41.1 65.24,10.72 C40.2 68.69,10.74 69.01,11.06 69.01,13.36 v69.28,13.64
  Top 1.27: 24V.2 91.71,82.95 90.91,83.75 90.91,90.99 | 90.91,90.99 90.91,94.01 90.46,94.46 90.46,94.97 XDIR.2 | 81.89,87.1 85.56,90.77 90.69,90.77 90.91,90.99
  Bottom 0.61: 16.34,67.78 16.03,67.46 16.03,66.51 14.12,64.6 v14.12,60.16 14.12,48.09 | 16.34,67.78 16.66,68.1 22.38,68.1 23.01,68.73 30.33,68.73 | 30.33,68.73 V2.7 32.27,71 33.17,71.91 v33.17,74.45 | 16.34,67.78 14.76,69.37 v14.76,73.18 14.76,81.11 14.12,81.75 v14.12,82.7 14.44,83.02 14.44,88.1 19.68,93.34 LASEROUT1.1 | v14.12,40.16 14.12,48.09 | v31.9,49.05 31.9,49.68 31.58,50 30.95,50 30.63,50.32 28.09,50.32 27.46,49.68 v23.33,49.68 | v23.33,47.46 20.15,47.46 19.2,48.41 14.44,48.41 14.12,48.09 | WATERTEMP.2 85.64,28.4 85.45,28.58 | 30.33,68.73 30.33,71.67 v29.55,72.45 | Q5.S 75.61,10.72 77.01,12.13 77.01,17.29 | 77.01,17.29 79.45,19.73 80.39,19.73 80.98,20.31 80.98,24.66 82.44,25.8 82.22,25.8 OKCHILL.K | 77.01,17.29 70.1,17.29 69.92,17.29 69.27,17.95 69.27,20.44 JP3.6 | v35.91,7.73 32.86,7.73 32.16,8.42 32.16,11.73 v30,14.08 | v22.79,19.33 14.87,19.33 v14.18,20.03 | X1.1 58.36,29.4 59.24,30.27 59.24,30.54 59.45,30.75 59.45,31.46 59.76,31.77 59.76,35.27 S1.3
  Bottom 0.813: XMIN.1 3.29,12.26 2.37,13.17 2.37,22.38 | 2.37,22.38 2.37,32.22 | 2.37,32.22 2.37,42.38 | 2.37,42.38 2.37,52.54 | 2.37,52.54 2.37,62.38 2.69,62.7 5.19,62.7 ZMAX.1 | ZMIN.1 2.41,52.58 2.37,52.54 | YMAX.1 2.41,42.42 2.37,42.38 | XMAX.1 2.41,22.42 2.37,22.38 | YMIN.1 2.41,32.26 2.37,32.22 | v63.73,47.83 62.55,47.83 v59.85,50.53 | v88.8,58.89 84.81,58.89 v84.58,58.66
  Bottom 1.016: v69.28,13.64 69.28,16.47 70.1,17.29
  Bottom 1.27: 24V.2 97.21,82.95 97.55,82.61 97.55,81.36 97.67,81.23 97.67,73.62 97.1,73.05 94.98,73.05 5V.2
  Bottom 1.422: OKCHILL.K 84.81,25.93 85.45,26.56 85.45,28.58 85.45,35.22 84.94,35.73 82.59,35.73 OKLIM1.K 84.88,35.96 85.74,36.82 85.74,45.91 84.98,46.67 82.47,46.67 OKLIM2.K 82.38,48.47 80.89,49.96 IC2.8
LASER_PROT  (via drill 0.6)
  Top 0.406: IC2.15 68.83,66.1 65.69,69.24 63.88,69.24 63.35,69.77 63.35,75.15 | 63.35,75.15 63.35,85.4 62.65,86.1 | OKWP.K 82.32,67.84 81.05,69.11 81.05,72.35 v79.05,74.35 | v64.07,74.64 63.85,74.64 63.35,75.15
  Top 0.61: 63.01,85.73 62.65,86.1 61.55,87.2 55.19,87.2 54.65,86.67 47.89,86.67 47.06,85.84 42.96,85.84 v42.92,85.79
  Top 0.813: LASEROUT1.3 29.68,92.23 26.82,89.37 v26.82,80.48 | V2.8 24.65,69.32 23.96,70 23.96,72.86 v23.65,73.18
  Bottom 0.406: v79.05,74.35 64.36,74.35 v64.07,74.64
  Bottom 0.61: v42.92,85.79 40.79,85.79 39.75,86.83 34.04,86.83 33.03,85.83 33.03,81.05 32.59,80.61 26.95,80.61 v26.82,80.48
  Bottom 0.813: v23.65,73.18 23.65,73.49 25.23,75.08 25.23,78.89 v26.82,80.48
LASERPWM  (via drill 0.6)
  Top 0.813: LASEROUT2.2 14.71,93.23 17.3,90.64 20.79,90.64 24.6,86.83 24.6,80.8 27.14,78.26 27.14,71.91 28.09,70.95 36.35,70.95 36.35,70.96 39.59,70.96 40.41,71.78 v44.09,71.78
  Bottom 0.813: IC1.11 45.24,54.44 44.73,55.22 44.73,62.66 45.7,64.25 45.7,70.65 44.61,71.74 44.12,71.74 v44.09,71.78
LASERTH  (via drill 0.6)
  Top 0.406: v62.76,60.53 62.76,61.39 64.69,63.32 68.17,63.32 IC2.16
  Top 0.61: R23.2 87.98,76.89 88.62,76.25 88.62,71.91 88.57,71.86 82.6,71.86 v82.34,72.12
  Top 0.813: LASEROUT2.1 9.71,91.24 11.58,89.37 20.15,89.37 22.69,86.83 22.69,79.53 23.65,78.57 24.92,78.57 25.87,77.62 25.87,71.27 27.46,69.68 40.42,69.68 v40.95,70.21 | IC1.12 46.51,56.67 42.59,56.73 41.76,57.51 41.76,64.31 42.34,64.83 44.2,64.89 v44.25,64.89
  Bottom 0.406: IC1.12 59.21,56.98 v62.76,60.53
  Bottom 0.61: v82.34,72.12 67.86,72.12 62.99,68.98 62.99,63.35 65.04,62.97 68.52,62.97 IC2.16
  Bottom 0.813: v44.25,64.89 44.21,69.89 43.88,70.21 v40.95,70.21
LCDMISO
  Bottom 0.61: JP3.1 74.15,23.77 73.22,24.7 73.22,56.41 71.96,57.68 68.92,57.68 IC2.18
LCDMOSI
  Bottom 0.61: JP3.4 71.61,19.83 72.33,19.11 74.95,19.11 75.73,19.9 75.73,23.83 74.38,25.18 74.38,58.61 72.85,60.13 IC2.17
LCDRESET  (via drill 0.6)
  Top 0.61: JP3.5 69.1,23.22 69.1,24.99 69.96,25.85 v75.43,25.85 76.02,25.85 77.94,27.77 77.94,28.18 79.2,29.44
  Top 0.813: R10.2 79.2,29.44
  Bottom 0.61: IC2.1 76.45,26.87 v75.43,25.85
LCDSCK
  Bottom 0.61: JP3.3 71.61,24.17 72.13,24.7 72.13,53.61 70.59,55.15 68.94,55.15 IC2.19
LIMITOK1  (via drill 0.6)
  Top 0.406: V1.12 25.74,35.27 26.82,36.35 26.82,49.05 30,52.22 30,56.03 30.63,56.67 32.24,56.67 V2.3 | v64.3,68.01 63.16,68.01 62.15,67 61.11,67 59.16,68.96 59.16,68.98 58.38,69.75 58.38,69.77 58.24,69.91 46.89,69.91 44.52,67.54 39.57,67.54 35.67,63.64 34.61,63.64 34.06,63.09 30.62,63.09 29.99,62.46 29.99,62.35 v29.69,62.04
  Top 0.61: R12.2 86.4,40.07 89.01,42.68 89.01,42.74 v88.98,42.78
  Bottom 0.406: IC2.14 72.82,65.2 70.55,67.47 64.83,67.47 v64.3,68.01 | v29.69,62.04 29.69,57.25 30.45,56.49 32.12,56.49 V2.3
  Bottom 0.61: v88.98,42.78 89.25,42.78 91.73,45.25 91.73,49.09 89.43,51.39 85.14,51.39 83.95,52.58 83.95,57.38 82.78,58.55 80.38,58.55 79.66,59.27 79.66,62.78 77.37,65.07 76.58,65.07 IC2.14
LIMITOK2  (via drill 0.6)
  Top 0.406: v64.36,66.28 60.7,66.28 57.94,69.04 47.26,69.04 45.06,66.84 39.96,66.84 35.97,62.86 35.2,62.86 34.45,62.1 34.45,61.35 V2.4
  Top 0.61: R14.2 87.06,46.54 88.09,45.51 88.22,45.51 v88.95,44.77
  Bottom 0.254: 33.17,59.21 33.14,59.17 V2.4
  Bottom 0.406: V1.6 34,42.89 35.08,43.97 35.09,49.48 34.55,50.2 34.57,51.61 34.56,52.39 34.56,58.37 | 34.56,58.37 33.64,59.2 33.17,59.21 | 34.56,58.37 34.56,58.33 34.57,58.33 | IC2.13 74.01,62.66 71.54,65.14 | 71.54,65.14 | 71.54,65.14 70.17,66.51 65.82,66.51 65.75,66.44 64.52,66.44 v64.36,66.28
  Bottom 0.61: v88.95,44.77 89.68,44.77 90.69,45.78 90.69,48.36 88.7,50.36 84.2,50.36 81.98,52.58 81.68,52.58 81.48,52.78 79.96,52.78 79.86,52.88 79.86,57.53 78.6,58.79 78.6,62.3 78.24,62.65 76.46,62.65 IC2.13
MCRTS  (via drill 0.6)
  Top 0.61: 41.55,21.55 C3.1 39.58,23.53 v39.28,23.53 | IC6.11 40.63,16.16 v40.57,16.22
  Bottom 0.61: v40.57,16.22 40.57,22.24 v39.28,23.53
MCRX
  Top 0.254: 54.92,21.71 SJ3.2
  Top 0.61: IC1.3 46.92,34.03 49.25,34.03 49.37,33.91 49.37,31.6 50.43,30.54 51.92,30.54 52.12,30.34 JP2.2 52.56,25.24 SJ2.2 54.92,21.71
MCRXPRE  (via drill 0.6)
  Top 0.61: IC6.12 44.35,14.89 44.76,14.49 44.76,10.13 v47.59,7.29 | v55.49,15.04 55.49,15.78 54.45,17.46 52.12,18.41 SJ2.1
  Bottom 0.61: v47.59,7.29 52.12,7.29 55.37,10.54 55.37,14.91 v55.49,15.04
MCTX  (via drill 0.6)
  Top 0.61: IC1.2 47.54,31.58 49.37,29.76 49.37,25.84 JP2.1 49.22,21.93 | 49.22,21.93 SJ1.2 | 49.22,21.93 47.33,21.93 46.19,20.79 v46.19,19.52 | v53.81,19.2 SJ4.2
  Bottom 0.61: v46.19,19.52 46.51,19.52 47.46,18.57 53.17,18.57 v53.81,19.2
MXTCPRE
  Top 0.61: SJ1.1 49.05,19.16 49.77,18.45 49.77,17.12 50.71,16.18 52.71,16.18 IC6.10
N$1
  Top 0.61: XSTEPLED.A R11.1
N$2
  Top 0.61: XDIRLED.A R16.1
N$3
  Top 0.406: AUX1.1 54,64.6 R2.2
N$4
  Bottom 0.813: V2.13 27.11,54.09 28.41,55.4 28.41,62.7 29.68,63.97 31.98,63.97 V2.6
N$5
  Top 1.27: OKLIM1.A 86.34,33.42 R12.1
N$6
  Top 0.61: YSTEPLED.A R17.1
N$7
  Top 0.61: YDIRLED.A R21.1
N$8  (via drill 0.6)
  Top 0.254: R13.2 29.36,25.23 29.53,25.4 29.53,25.74
  Top 0.406: v34.48,26.5 30.34,26.5 29.59,25.74 29.53,25.74 29.37,25.9
  Bottom 0.406: 34.38,41.56 34.34,41.59 33.06,41.59 33.04,41.61 | 33.04,41.61 28.69,41.61 27.25,43.04 24.93,43.04 V1.9 | 33.04,41.61 35.2,41.61 35.74,41.07 35.79,27.88 v34.48,26.5
N$9
  pour Bottom: -2.39,1.42 -2.39,99.53 2,100.27 96.62,100.27 103.66,96.36 103.66,3.01 97.31,-3.34 2.38,-3.34
N$10
  Top 1.27: OKLIM2.A 86.08,44.05 R14.1
N$11
  Top 1.27: OKDOOR.A 86.04,53.85 R19.1
N$14
  Top 1.27: OKCHILL.A 85.87,23.39 R20.1
N$15
  Top 1.27: OKWP.A 86.24,63.94 R22.1
N$17
  Top 1.27: TH_ON.A 86.4,74.13 R23.1
N$18
  Top 1.27: R24.1 82.42,84.82 VCCOK.A
N$19
  Top 0.813: R25.1 16.21,12.72 FXM.A
N$20
  Top 0.813: R26.1 16.85,23.2 FXP.A
N$21
  Top 0.813: R27.1 16.85,33.04 FYM.A
N$22
  Top 0.813: R28.1 16.85,43.2 FYP.A
N$23
  Top 0.813: R29.1 16.85,53.04 FZM.A
N$24
  Top 0.813: R30.1 16.85,63.2 FZP.A
N$30
  Top 0.61: Q5.G 76.13,5.57 74.94,4.37 71.45,4.37 R58.2
N$31
  Top 1.27: AIR-ON.A 82.38,10.88 R59.1
N$71
  Top 0.813: IC6.2 58.42,6 Q8.1
  Top 1.016: C41.2 59.75,4.67 Q8.1
N$72
  Top 0.813: IC6.3 56.8,7.27 57.71,8.18 57.71,12.88 58.4,13.57 58.6,13.57 Q8.2
  Top 1.016: C40.1 60.53,13.54 Q8.2
N$74
  Top 0.406: X3.D- 28.47,11.54 28.94,13.02
  Top 0.61: 28.94,13.02 37.21,13.07 39.95,9.92 39.95,8.11 40.75,7.31 42.71,7.29 IC6.18
N$75
  Top 0.406: X3.D+ 29.27,10.85 30.23,12.1
  Top 0.61: 30.23,12.1 36.82,12.09 38.9,9.5 38.9,7.27 40.1,6.07 42.68,6.05 IC6.19
N$76
  Top 0.61: C42.2 37.92,13.86 40.88,10.36 40.88,8.89 41.15,8.61 42.7,8.58 IC6.17
N$79
  Top 0.61: IC6.4 50.38,8.54 45.99,12.93 45.99,16.16 45.56,16.6 45.53,16.6 45.17,16.95 44.25,16.95 43.41,17.79 36.61,17.79 36.06,18.34 36.06,20.88 R47.1
N$80  (via drill 0.6)
  Top 0.61: IC6.6 50.75,11.08 47.85,13.98 47.87,16.76 46.67,17.96 44.52,17.96 44.52,18.05 43.41,19.16 38.01,19.16 v37.88,19.04 | v34.27,19.03 33.99,19.03 33.38,19.65 33.41,20.95 R49.2
  Bottom 0.61: v37.88,19.04 34.43,19.04 v34.27,19.03
N$81  (via drill 0.6)
  Top 0.61: TXLED3.C 19,4.01 18.52,4.49 18.52,7.68 19.61,8.77 20.45,8.77 20.83,9.15 20.83,10.96 24.68,14.8 v24.68,17.67 | v25.56,23.14 26.43,22.28 29.3,22.26 R49.1
  Bottom 0.61: v25.56,23.14 25.56,18.56 v24.68,17.67
NANDOK
  Top 0.61: V2.12 V2.11
RESET
  Top 0.813: IC1.1 46.82,26.33 45.8,25.31 44.49,25.31 R1.2 44.35,21.74 C3.2
  Bottom 0.61: IC1.1 51.96,29.04 53.04,30.12 | 53.04,30.12 53.04,32.42 52.8,32.66 51.35,32.66 S1.2 S1.1 | X1.2 56.11,26.02 55,27.13 55,29.38 54.21,30.17 53.09,30.17 53.04,30.12
RS
  Top 0.406: JP1.4 65.55,39.34 67.52,37.36 68.73,37.36 IC2.26
RW
  Top 0.406: JP1.5 65.33,41.88 67.3,39.91 68.72,39.91 IC2.25
RX  (via drill 0.6)
  Top 0.61: SJ3.1 57.11,23.14 58.25,24.28 58.57,24.28 v58.89,23.96 | 76.41,34.76 IC2.2 | v68.73,28.73 74.13,28.73 74.13,34.44 74.45,34.76 76.03,34.76 75.75,34.72 IC2.2 | IC2.2 76.73,34.44 JP4.1
  Bottom 0.61: v58.89,23.96 59.52,23.96 60.48,24.92 60.48,26.19 62.06,27.77 62.7,27.77 63.33,28.41 66.19,28.41 66.51,28.73 v68.73,28.73
SCL
  Bottom 0.61: IC2.28 69.43,32.18 70.16,31.45 70.16,26.45 70.04,26.33 64.16,26.33 62.38,24.55 62.38,21.42 62.66,20.83 62.4,21.15 62.95,20.6 63.95,20.6 JP3.10
SDA
  Bottom 0.61: IC2.27 70.4,34.72 71.19,33.94 71.19,25.6 70.71,25.12 64.55,25.12 64.07,24.63 64.07,23.27 JP3.9
SDS
  Top 0.61: JP3.7 66.53,25.39 67.46,26.33 67.46,29.36 68.1,30 72.22,30 73.18,30.95 73.18,41.43 74.45,42.7 74.45,44.6 74.84,45 76.34,45 IC2.6
SFRX
  Top 0.61: IC2.4 79,39.8 JP5.1
SFTX
  Top 0.61: IC2.5 79.03,42.34 JP5.2
TX  (via drill 0.6)
  Top 0.61: SJ4.1 57.94,19.2 58.89,20.15 v58.89,22.69 | v68.73,27.46 74.45,27.46 75.4,28.41 75.4,30.63 75.72,30.95 77.94,30.95 78.57,31.58 78.57,32.54 78.89,32.85 80.48,32.85 81.11,33.49 81.11,37.3 81.08,37.34 JP4.2 79.15,37.26 IC2.3
  Bottom 0.61: v58.89,22.69 59.52,22.69 61.43,24.28 61.43,25.55 62.7,26.82 63.33,26.82 63.97,27.46 v68.73,27.46
VCC  (via drill 0.6)  (2 unrouted)
  Top 0.406: V1.14 24.77,27.05 R13.1 | IC2.7 74.63,47.42 74.13,47.93 71.2,47.93 v71.03,47.74
  Top 0.61: V2.14 26.15,51.55 26.82,52.22 26.82,63.97 26.5,64.29 24.68,64.29 V2.9 | V2.1 32.27,51.22 34.12,49.36 IC1.20 | CHILLER.1 94.21,43.44 89.2,48.46 77.48,48.46 IC2.7 | v28.6,84.75 29.35,83.99 C10.1 30.63,78.86 v30.63,79.21 | R22.2 88.21,66.63 92.29,70.71 92.29,76.84 93.65,78.2 | WATERTEMP.1 92.8,33.4 v89.42,29.87 | v87.05,29.91 82.83,29.93 R10.1 | C14.+ 13.47,8.09 16.66,8.09 19.01,10.44 R25.2 | v33.17,79.21 33.17,78.26 33.49,77.94 C13.+
  Top 0.813: R9.2 15.36,17.26 16.03,17.93 19.2,17.93 | 19.2,17.93 19.84,18.57 19.84,19.33 R26.2 19.65,20.28 20.47,21.11 20.47,29.17 R27.2 | R8.2 18.5,27.39 19.2,28.09 19.2,29.55 R27.2 | R7.2 15.68,37.27 16.66,38.25 19.2,38.25 19.84,38.89 | 19.84,38.89 19.84,38.25 20.47,37.3 20.47,30.63 19.84,30 R27.2 | 19.84,38.89 19.84,40.6 R28.2 19.65,41.24 20.15,42.38 20.15,48.73 19.84,49.05 | R6.2 15.71,47.46 16.66,48.41 19.2,48.41 19.84,49.05 | 19.84,49.05 19.84,50.45 R29.2 19.65,51.4 20.15,52.22 20.15,59.97 R30.2 | R5.1 15.62,57.53 16.66,58.57 18.57,58.57 19.2,59.21 19.2,59.84 19.84,60.48 19.84,60.61 R30.2 | 19.84,69.37 19.84,68.73 19.2,68.1 16.66,68.1 16.33,67.77 R4.1 14.12,67.88 14.12,70.64 11.86,72.9 DOOR1.1 | 19.84,69.37 19.84,70.45 | 19.2,17.93 19.84,17.93 20.47,17.3 20.47,12.4 R25.2 | R30.2 20.15,60.79 v20.15,63.97 20.15,70 19.84,69.37 | 19.65,71.08 20.15,71.91 v20.15,78.57 | v20.15,78.57 20.15,80.29 20.07,80.43 20.15,80.34 v20.15,78.57 | LASEROUT1.2 24.68,92.31 v24.28,91.91 | C9.2 22.85,28.26 V1.14 | 86.4,66.59 R22.2 | R13.1 26.57,23.93 27.06,23.44 31.2,23.37 31.2,25.32 36.64,25.32 37.42,26.2 38.04,26.93 40.84,26.92 R1.1 | 76.68,47.19 IC2.7 | 89.2,48.46 89.2,50.36 C7.2 | R24.2 86.45,87.78 v88.73,87.78 | v73.81,88.1 73.81,87.78 73.82,87.79 C17.+
  Top 1.016: 20.47,30.63 24.33,30.63 V1.14
  Top 1.27: R24.2 88.76,87.62 89.01,87.37 89.01,82.64 93.45,78.2 93.65,78.2 94.71,78.2 5V.1 | JP3.2 76.84,20.64 v77.3,21.11 | v78.89,26.19 78.89,26.5 79.53,27.14 80.8,27.14 82.38,28.73 82.38,29.39 R10.1
  Bottom 0.406: AUX1.2 63.55,62.06 65.4,60.21 66.46,60.21 66.89,59.78 66.89,53.46 66.89,53.12 67.26,52.74 67.4,52.6 68.73,52.6 IC2.20 69.05,52.28 70.97,52.28 71.03,52.22 v71.03,47.74
  Bottom 0.61: V2.14 V2.1 V2.2 | V2.9 20.44,64.25 v20.15,63.97 | IC1.20 42.42,49.36 44.21,47.57 44.21,45.1 44.98,44.33 46.78,44.33 IC1.7 | v28.6,84.75 24.33,84.75 24.28,84.7 | v89.42,29.87 87.1,29.93 v87.05,29.91 | v30.63,79.21 v33.17,79.21
  Bottom 0.813: DOOR2.1 3.05,83.06 2.06,82.07 2.06,73.18 2.69,72.54 4.87,72.54 DOOR1.1 | v24.28,91.91 24.28,84.7 24.28,82.7 v20.15,78.57 | JP1.2 65.36,34.26 66.18,35.07 66.18,51.66 67.26,52.74 | 44.21,47.57 44.21,45.25 45.25,44.21 53.22,44.21 55.75,46.74 55.75,53.02 57.05,54.33 66.01,54.33 66.89,53.46 | v88.73,87.78 88.73,89.37 88.42,89.69 75.4,89.69 v73.81,88.1
  Bottom 1.27: v77.3,21.11 77.3,24.6 v78.89,26.19
  Bottom 1.422: 97.19,33.36 97.71,33.88 97.71,42.72 96.99,43.44 CHILLER.1 97.02,43.44 97.74,44.15 97.74,67.92 95.67,69.98 93.01,69.98 91.74,71.26 91.74,76.75 92.61,77.62 94.55,77.62 5V.1 | 94.97,33.36 WATERTEMP.1
  pour Top: -3.02,-0.16 -3.02,98.89 1.31,100.49 97.83,100.49 102.07,97.94 102.07,1.42 97.62,-3.02 -0.17,-3.02
VUSB  (via drill 0.6)
  Top 0.406: X3.VBUS 27.67,11.32 | 27.67,11.32 27.08,11.9 | 27.67,11.32 27.62,11.32 26.81,12.12 23.7,12.12 21.76,10.18 21.76,7.56 TXLED3.A | 27.67,11.32 27.67,14.57
  Top 0.61: IC6.1 52.87,4.6 52.87,3.49 51.32,2.29 38.28,2.29 37.5,2.89 C43.1 37.51,5.13 v36.68,5.96 | 27.67,14.57 28.73,15.64 v28.73,16.24 | R47.2 38.58,22.1 v37.12,23.56
  Bottom 0.61: v37.12,23.56 34.48,23.56 33.95,23.03 33.95,21.29 31.31,18.65 | 31.31,18.65 31.14,18.65 v28.73,16.24 | v36.68,5.96 36.68,6.47 37.46,7.25 37.46,16.54 37.31,16.69 33.26,16.69 31.31,18.65
WATERTEMP  (via drill 0.6)
  Top 0.61: WATERTEMP.3 92.44,20.9 84.33,20.9 83.76,21.47 80.71,21.47 79.48,22.69 v79.21,22.69 | IC2.23 70.14,46.19 v78.26,46.19
  Bottom 0.61: v79.21,22.69 79.84,23.33 79.84,25.23 81.43,26.82 81.43,29.04 81.11,29.36 81.11,45.87 80.8,46.19 v78.26,46.19
X1LIMIT
  Top 0.61: V1.5 32.58,40.16 35.71,40.16 36.98,41.43 38.89,41.43 IC1.23
  Top 0.813: XMIN.2 R9.1 11.04,15.39 | 11.04,15.39 11.04,12.32 C4.2 | FXM.K 16.98,16.34 15.39,14.76 11.68,14.76 11.04,15.39
  Bottom 0.406: FXM.K 27.14,16.34 32.54,21.74 32.54,26.19 35.08,28.73 35.08,40.16 34.44,40.79 32.84,40.79 V1.5
X2LIMIT
  Top 0.61: V1.4 32.54,37.66 32.54,37.62 35.71,37.62 36.98,38.89 38.89,38.89 IC1.24
  Top 0.813: XMAX.2 11.02,27.42 R8.1 11.03,24.92 | 11.03,24.92 11.03,22.56 C5.2 | FXP.K 16.34,25.87 15.39,24.92 11.03,24.92
  Bottom 0.406: FXP.K 30.95,25.87 34.23,29.27 34.23,36.89 33.81,37.62 32.58,37.62 V1.4
XDIR  (via drill 0.6)
  Top 0.61: R16.2 v54.76,84.29
  Top 0.813: XDIR.1 85.49,94.38 82.38,91.27 74.13,91.27 73.18,90.32 63.97,90.32 62.06,88.42 v55.08,88.42 54.76,88.42 54.13,87.78 47.14,87.78 46.51,87.15 41.74,87.15 41.43,86.83 41.43,84.61 v38.89,82.07
  Bottom 0.61: v54.76,84.29 55.08,84.61 v55.08,88.42
  Bottom 0.813: IC1.17 40.47,56.98 42.43,59.49 42.46,62.7 41.43,65.24 39.84,65.24 39.52,65.56 39.52,70.64 39.84,70.95 39.84,73.18 38.25,74.76 38.25,81.43 v38.89,82.07
XSTEP  (via drill 0.6)
  Top 0.61: R11.2 59.52,82.83 v59.52,84.92
  Top 0.813: XSTEP.1 72.54,91.59 63.33,91.59 61.43,89.69 v59.52,89.69 54.13,89.69 53.49,89.05 46.51,89.05 45.87,88.42 41.11,88.42 38.89,86.19 v38.89,84.61
  Bottom 0.61: v59.52,84.92 v59.52,89.69
  Bottom 0.813: v38.89,84.61 39.2,84.61 40.47,83.34 40.47,81.11 39.52,80.16 39.52,75.4 41.48,73.44 45.23,73.44 47.12,71.55 47.12,63.69 46.82,63.4 IC1.14
XTAL1
  Top 0.61: IC1.9 51.27,49.36 52.86,47.78 Y1.2 57.87,45.81 C1.1
XTAL2
  Top 0.61: IC1.10 51.27,51.9 52.54,53.17 52.54,55.14 Y1.1 57.87,55.46 C2.1
XTAL3
  Top 0.61: IC2.10 74.74,55.04 73.85,55.94 73.85,68.28 Y2.1 76.81,76.82 C12.1
XTAL4
  Top 0.61: IC2.9 73.25,52.5 71.55,54.21 71.55,69.39 70.08,70.86 67.54,70.86 Y2.2 67.16,75.76 C8.1
Y1LIMIT
  Top 0.61: V1.3 35.9,35.27 36.98,36.35 38.89,36.35 IC1.25
  Top 0.813: YMIN.2 11.09,37.26 R7.1 11.1,35.08 | 11.1,35.08 11.1,32.26 C6.2 | 11.1,35.08 11.73,34.44 16.03,34.44 16.03,34.76 FYM.K
  Bottom 0.406: 21.74,35.71 22.18,36.49 31.12,36.49 V1.3
  Bottom 0.813: 21.74,35.71 17.61,35.71 FYM.K
Y2LIMIT  (via drill 0.6)
  Top 0.406: 29.68,34.12 30.63,33.17 31.95,33.17 V1.2
  Top 0.61: V1.2 35.9,32.73 36.98,33.81 38.89,33.81 IC1.26 | v29.68,38.89 29.68,34.12
  Top 0.813: YMAX.2 11.07,47.42 R6.1 11.1,45.24 | 11.1,45.24 C11.2 | FYP.K 16.98,46.19 16.03,45.24 11.1,45.24
  Bottom 0.406: FYP.K 16.98,46.19 | 22.69,39.2 23.88,39.2 24,39.08 26.3,39.08
  Bottom 0.61: FYP.K 20.15,46.19 21.74,44.6 21.74,40.16 22.69,39.2 | 26.3,39.08 29.48,39.08 v29.68,38.89
YDIR  (via drill 0.6)
  Top 0.61: R21.2 44.92,83.47 v44.92,84.29
  Top 0.813: YDIR.1 64.52,95 60.48,90.96 53.49,90.96 52.86,90.32 v45.55,90.32 44.92,89.69 40.47,89.69 36.98,86.19 v36.98,84.61
  Bottom 0.61: v44.92,84.29 45.55,84.92 v45.55,90.32
  Bottom 0.813: IC1.18 37.62,54.44 37.02,55.05 36.98,59.78 35.71,61.43 35.71,83.34 v36.98,84.61
YSTEP  (via drill 0.6)
  Top 0.61: R17.2 v50.32,84.61
  Top 0.813: YSTEP.1 55.01,94.38 52.22,91.59 v50.32,91.59 44.92,91.59 44.28,90.96 39.84,90.96 35.71,86.83 35.71,83.34 v36.98,82.07
  Bottom 0.61: v50.32,84.61 v50.32,91.59
  Bottom 0.813: IC1.15 37.93,62.06 36.98,63.02 v36.98,82.07
Z1LIMIT  (via drill 0.6)
  Top 0.406: V1.1 31.08,30.19 28.09,33.17 28.09,47.78 v29.36,49.05
  Top 0.61: V1.1 35.9,30.19 36.98,31.27 38.89,31.27 IC1.27
  Top 0.813: ZMIN.2 R5.2 11.16,54.76 | 11.16,54.76 11.16,52.59 C15.2 | FZM.K 16.98,56.35 15.39,54.76 11.16,54.76
  Bottom 0.406: FZM.K 17.93,56.03 19.84,56.03 22.06,53.81 22.06,48.73 29.04,48.73 v29.36,49.05
Z2LIMIT  (via drill 0.6)
  Top 0.406: C16.2 11.17,65.34 10.95,65.56 v10.31,64.92
  Top 0.61: V1.13 26,32.73 30.63,28.09 35.71,28.09 IC1.28
  Top 0.813: ZMAX.2 R4.2 11.21,65.56 | 11.21,65.56 11.21,62.81 C16.2 | FZP.K 16.34,66.51 15.39,65.56 11.21,65.56
  Bottom 0.406: v10.31,64.92 10.31,34.44 14.12,30.63 19.84,30.63 22.38,33.17 24.33,33.17 V1.13
ZDIR  (via drill 0.6)
  Top 0.813: ZDIR.1 44.85,94.06 43.01,92.23 39.2,92.23 34.44,87.46 v34.44,84.61
  Bottom 0.813: IC1.19 36.66,51.9 35.74,52.92 35.71,59.32 34.44,60.79 v34.44,84.61
ZSTEP  (via drill 0.6)
  Top 0.813: ZSTEP.1 34.69,89.62 31.9,86.83 v31.9,73.18 37.93,73.18 v38.57,72.22
  Bottom 0.813: IC1.16 40.79,59.52 41.36,60.32 41.36,62.54 40.47,63.97 38.89,63.97 38.25,64.6 38.25,71.59 v38.57,72.22

### Text on the board
Top: CC-BY-SA | H4H
Bottom: Sept 2014 | Design by: | Thanks Mark! | Peter vd Walt | Sponsored by: www.OpenBuilds.com FairShare Program
bPlace: TH | PWM | GND | 5V | WP | SIG | GND | SIG | GND | SIG | GND | SIG | GND | SIG | GND | SIG | GND | LASERPSU | ZSTEP | ZDIR | YSTEP | YDIR | XSTEP | XDIR | SIG | 24V-IN | 24V | DOOR2 | 5V | GND | SIG | 5V | BEAM | 5V-IN | DOOR1 | Y-STEP | Y-DIR | X-STEP | X-DIR | 5V | GND | SIG | WP-OK | ZMAX | GND | SIG | DOOR | ZMIN | GND | SIG | GLCD | LIMIT | YMAX | EN | 5V | FLOW | RW | GND | RS | SIG | N/C | LIMIT | YMIN | VCC | WATERTEMP | 5V | GND | GND | D4SS | SIG | SDA | SCK | MISO | RST | FLOW | XMAX | GND | GND | SIG | SCL | N/C | GND | MOSI | VCC | VALVE | AIR | GND | XMIN | 24V | GND
tCream: CC-BY-SA
bCream: Design by: | Thanks Mark! | Peter vd Walt | Sponsored by: www.OpenBuilds.com FairShare Program
OPENHWSILK: TH | PWM | GND | 5V | WP | GND | GND | GND | GND | GND | GND | SIG | SIG | SIG | SIG | SIG | SIG | LASERPSU | ZSTEP | ZDIR | YSTEP | YDIR | XSTEP | XDIR | POWER | 1K | SIG | LaserCutter Controller V3 | 24V | 24V | 10k | 10u | 5V | DOOR2 | GND | 1k | H4H | 22P | 22P | 1K | LASER | 5V | 5V | SIG | 104 | 10u | 16Mhz | 10k | 5V | DOOR1 | GND | 1k | YDIR | XDIR | WP | 1K | 1K | 10k | Openhardware.co.za | YSTEP | XSTEP | SIG | 10R | AUX2 | VCC | GND | ZMAX | 104 | /LCD | 1k | GND | COOL | DOOR | 1K | FAULT | 22P | SIG | 10k | 104 | GND | ZMIN | 104 | 10K | 7410 | 1k | 22P | LIMIT | 1K | GLCD | SIG | 10k | ST7290 | EN | 16Mhz | 5V | RW | STX | YMAX | 104 | GND | 1k | RESET | RS | SRX | 1K | TX | N/C | 10k | CHILLER | CHILL | SIG | VCC | ATMEGA328P-MONITORING | 104 | GND | ATMEGA328P-LASAURGRBL | 5V | YMIN | 104 | RESET | 10k | RX | LIMIT | GND | 1k | 7411 | RX | TX | 1K | SIG | 10k | 10k | MISO | GND | SDA | D4SS | RST | SCK | 10K | AIR | WATERTEMP | XMAX | 104 | LM35 | GND | 1k | 10k | 104 | 1k | 104 | SIG | 10k | GND | SCL | N/C | GND | VCC | 22P | MOSI | DIODE | GND | XMIN | 104 | AIRVALVE | 24V | 1k | 12Mhz | 22P | LED | + | 104 | 1K | 10R | USB | 10u | RX